# Altium schematic sheet Power.SchDoc
size A4; SheetNumber: 1; SheetTotal: 3
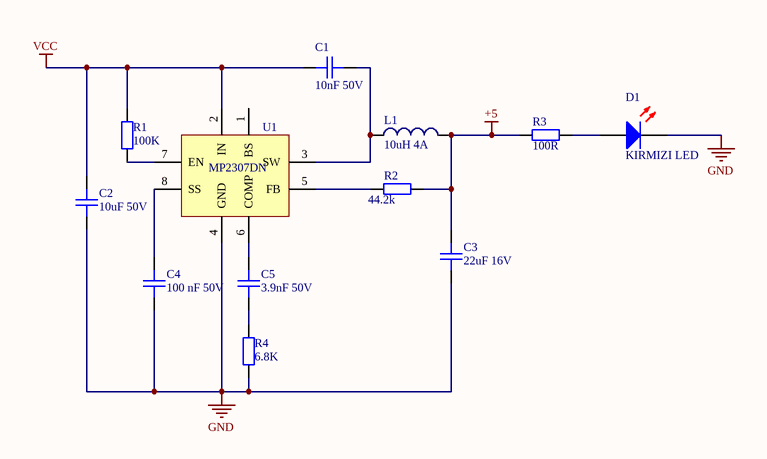
[diagram p0: Power.SchDoc]

## Parts
C1  Deger: 10nF 50V  [CAP-0805(2012)]  (hidden comment: CAP CER 10000PF 50V X7R 0805)
C2  Deger: 10uF 50V  [CAP 1206/3216]  (hidden comment: CAP CER 10UF 50V X5R 1206)
C3  Deger: 22uF 16V  [CAP 1206/3216]  (hidden comment: CAP CERAMIC 22UF 16V X7S 20% PAD)
C4  deger: 100 nF 50V  [CAP-0805(2012)]  (hidden comment: CAP CER 0.1UF 50V X7R 0805)
C5  Deger: 3.9nF 50V  [CAP-0805(2012)]  (hidden comment: CAP CER 3900PF 50V X7R 0805)
D1  Deger: KIRMIZI LED  [SMD: LED 0805/2012 RED]  (hidden comment: Red 645nm LED Indication - Discrete 1.8V 0805)
L1  FIXED IND 10UH 4A 68 MOHM SMD  [ASPI-0630LR-100M-T15]  (value not drawn)
R1  Deger: 100K  [RES-0805]  (hidden comment: RES SMD 100K OHM 1% 1/8W 0805)
R2  deger: 44.2k  [RES-0805]  (hidden comment: RES SMD 44.2K OHM 1% 1/8W 0805)
R3  Deger: 100R  [RES-0805]  (hidden comment: RES SMD 100 OHM 1% 1/8W 0805)
R4  Deger: 6.8K  [RES-0805]  (hidden comment: RES SMD 6.8K OHM 1% 1/8W 0805)
U1  IC REG BUCK ADJ 3A 8SOIC  [SOIC8-PAD]  (value not drawn)

## Nets
+5: C3.2 L1.2 R2.2 R3.1
GND: C2.1 C3.1 C4.1 D1.2(K) R4.1 U1.4(GND)
VCC: C1.1 C2.2 R1.2 U1.2(IN)
NetC1_2: C1.2 L1.1 U1.3(SW)
NetC4_2: C4.2 U1.8(SS)
NetC5_1: C5.1 R4.2
NetC5_2: C5.2 U1.6(COMP)
NetD1_1: D1.1(A) R3.2
NetR1_1: R1.1 U1.7(EN)
NetR2_1: R2.1 U1.5(FB)

Not connected (* = marked no-connect by the designer): U1 1(BS)

## Library data of the parts
C1 = 10nF 50V 0805: 10000pF ±10% 50V Ceramic Capacitor X7R 0805 (2012 Metric); Cins: Kondansator; Uretici Kodu: CL21B103KBANNNC; Kılıf: 0805; -Sicaklik: -55; +Sicaklik: +125; Lehim Yöntemi: SMD; MSL: 1 (Unlimited)
C2 = 10uF 50V 1206: 10µF ±10% 50V Ceramic Capacitor X5R 1206 (3216 Metric); Cins: Kondansator; Uretici Kodu: CL31A106KBHNNNE; Kılıf: 1206; -Sicaklik: -55; +Sicaklik: +125; Lehim Yöntemi: SMD; MSL: 1 (Unlimited)
C3 = 22uF 16V 1206: 22µF ±20% 16V Ceramic Capacitor X7S 1206 (3216 Metric); Cins: Kondansator; Uretici Kodu: GRM31CC71C226ME11L; Kılıf: 1206; -Sicaklik: -55; +Sicaklik: +125; Lehim Yöntemi: SMD; MSL: 1 (Unlimited)
C4 = 100nF 50V 0805: 0.1 µF ±10% 50V Ceramic Capacitor X7R 0805 (2012 Metric); üretici kodu: CL21B104KBCNNNC; sıcaklık +: +125; sıcaklık -: -55; kılıf: 0805; cins: kondansatör; lehim yöntemi: smd; MSL: 1 (Unlimited)
C5 = 3.9nF 50V 0805: 3900pF ±10% 50V Ceramic Capacitor X7R 0805 (2012 Metric); Cins: Kondansator; Uretici Kodu: CL21B392KBANNNC; Kılıf: 0805; -Sicaklik: -55; +Sicaklik: +125; Lehim Yöntemi: SMD; MSL: 1 (Unlimited)
D1 = LED_Kırmızı: LED RED DIFFUSED 0805 SMD; Uretici Kodu: LH R974-LP-1; Kılıf: 0805; -Sicaklik: -40; +Sicaklik: +125; Cins: LED; Lehim Yöntemi: SMD; MSL: 1 (Unlimited)
L1 = 10uH 4A: 10µH Shielded Molded Inductor 4A 68mOhm Max Nonstandard; Cins: Bobin; -Sicaklik: -55; +Sicaklik: +125; Uretici Kodu: ASPI-0630LR-100M-T15; Kılıf: Nonstandard; Lehim Yöntemi: SMD; MSL: 1 (Unlimited); Deger: 10uH 4A
R1 = 100K 0805: 100 kOhms ±1% 0.125W, 1/8W Chip Resistor 0805 (2012 Metric) Moisture Resistant Thick Film; Cins: Direnc; Uretici Kodu: RC0805FR-07100KL; Kılıf: 0805; -Sicaklik: -55; +Sicaklik: +155; Lehim Yöntemi: SMD; MSL: 1 (Unlimited)
R2 = 44.2K 0805: 44.2 kOhms ±1% 0.125W, 1/8W Chip Resistor 0805 (2012 Metric) Moisture Resistant Thick Film; Cins: Direnc; Uretici Kodu: RC0805FR-0744K2L; Kılıf: 0805; -Sicaklik: -55; +Sicaklik: +155; Lehim Yöntemi: SMD; MSL: 1 (Unlimited)
R3 = 100R 0805: 100 Ohms ±1% 0.125W, 1/8W Chip Resistor 0805 (2012 Metric) Moisture Resistant Thick Film; Cins: Direnc; Uretici Kodu: RC0805FR-07100RL; Kılıf: 0805; -Sicaklik: -55; +Sicaklik: +155; Lehim Yöntemi: SMD; MSL: 1 (Unlimited)
R4 = 6.8K 0805: 6.8 kOhms ±1% 0.125W, 1/8W Chip Resistor 0805 (2012 Metric) Moisture Resistant Thick Film; Cins: Direnc; Kılıf: 0805; Uretici Kodu: RC0805FR-076K8L; -Sicaklik: -55; +Sicaklik: +155; Lehim Yöntemi: SMD; MSL: 1 (Unlimited)
U1 = MP2307DN: Buck Switching Regulator IC Positive Adjustable 0.925V 1 Output 3A 8-SOIC (0.154", 3.90mm Width) Exposed Pad; Üretici Kodu: MP2307DN-LF-Z; sıcaklık +: +85; sıcaklık: -40; lehim yöntemi: SMD; kılıf: 8-SOIC; cins: IC; MSL: 2A(4 weeks); deger: MP2307DN